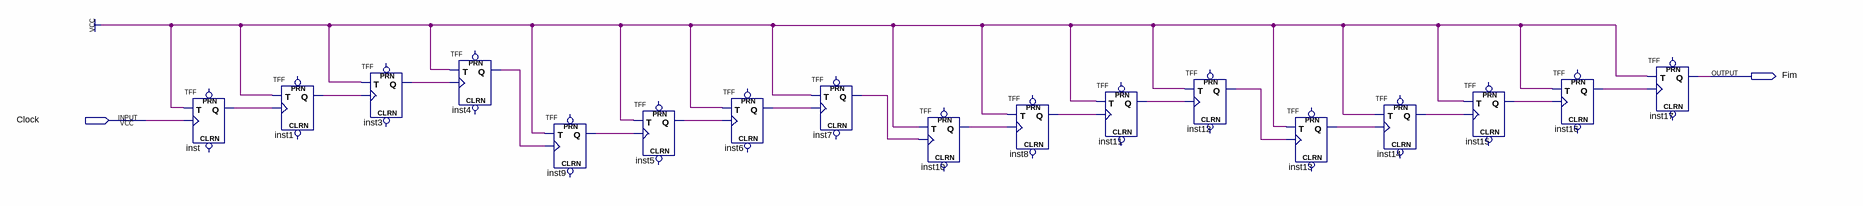
[diagram p0: schematic sheet]
// Quartus schematic DivisorFrequencia.bdf as structural Verilog: 17 symbols, 2 pins
module DivisorFrequencia (
  input  Clock,
  output Fim
);

  wire inst1_q, inst3_q, inst4_q, inst5_q, inst6_q, inst7_q, inst8_q, inst9_q, inst10_q, inst11_q, inst12_q,
       inst13_q, inst14_q, inst15_q, inst16_q, inst_q;

  TFF inst (.T(1'b1), .CLK(Clock), .Q(inst_q));  // open: PRN, CLRN
  TFF inst1 (.T(1'b1), .CLK(inst_q), .Q(inst1_q));  // open: PRN, CLRN
  TFF inst3 (.T(1'b1), .CLK(inst1_q), .Q(inst3_q));  // open: PRN, CLRN
  TFF inst4 (.T(1'b1), .CLK(inst3_q), .Q(inst4_q));  // open: PRN, CLRN
  TFF inst9 (.T(1'b1), .CLK(inst4_q), .Q(inst9_q));  // open: PRN, CLRN
  TFF inst5 (.T(1'b1), .CLK(inst9_q), .Q(inst5_q));  // open: PRN, CLRN
  TFF inst6 (.T(1'b1), .CLK(inst5_q), .Q(inst6_q));  // open: PRN, CLRN
  TFF inst7 (.T(1'b1), .CLK(inst6_q), .Q(inst7_q));  // open: PRN, CLRN
  TFF inst10 (.T(1'b1), .CLK(inst7_q), .Q(inst10_q));  // open: PRN, CLRN
  TFF inst8 (.T(1'b1), .CLK(inst10_q), .Q(inst8_q));  // open: PRN, CLRN
  TFF inst11 (.T(1'b1), .CLK(inst8_q), .Q(inst11_q));  // open: PRN, CLRN
  TFF inst12 (.T(1'b1), .CLK(inst11_q), .Q(inst12_q));  // open: PRN, CLRN
  TFF inst13 (.T(1'b1), .CLK(inst12_q), .Q(inst13_q));  // open: PRN, CLRN
  TFF inst14 (.T(1'b1), .CLK(inst13_q), .Q(inst14_q));  // open: PRN, CLRN
  TFF inst15 (.T(1'b1), .CLK(inst14_q), .Q(inst15_q));  // open: PRN, CLRN
  TFF inst16 (.T(1'b1), .CLK(inst15_q), .Q(inst16_q));  // open: PRN, CLRN
  TFF inst17 (.T(1'b1), .CLK(inst16_q), .Q(Fim));  // open: PRN, CLRN
endmodule
